# EAGLE design untitled2 (EAGLE 9.6.2)
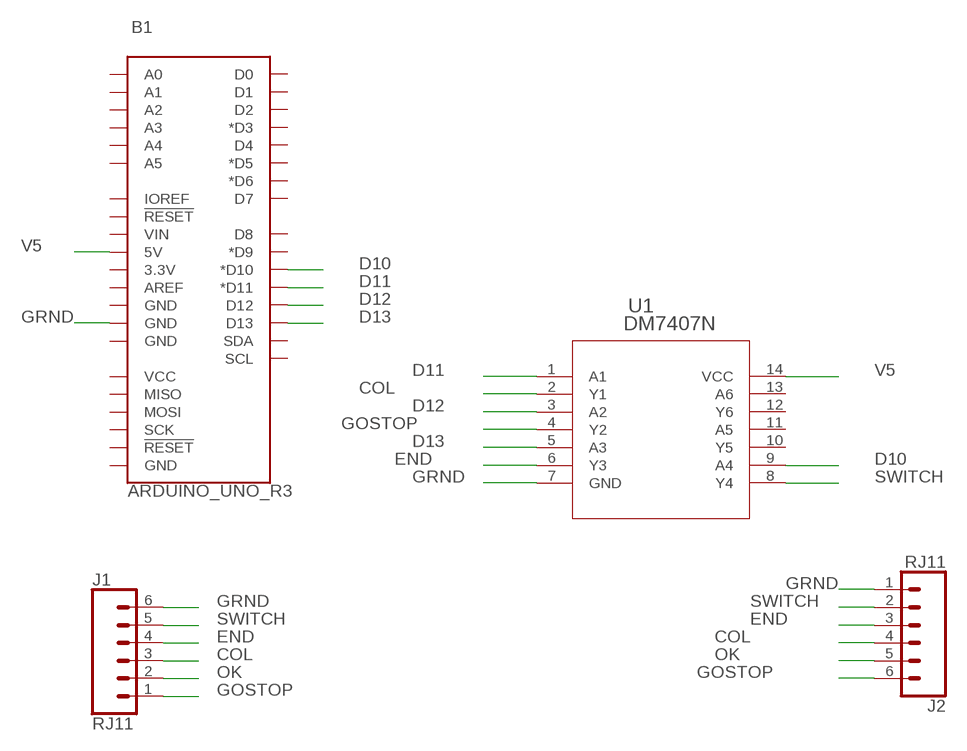
[diagram p0: schematic, sheet 1]

## Parts
B1  ARDUINO_UNO_R3  [ARDUINO_R3]
J1  RJ11  RJ11-6  [RJ11-6]
J2  RJ11  RJ11-6  [RJ11-6]
U1  DM7407N  [PDIP14_6P35X19P56_ONS]

## Nets
COL: J1.3 J2.4 U1.2(Y1)
D10: B1.D10(*D10) U1.9(A4)
D11: B1.D11(*D11) U1.1(A1)
D12: B1.D12 U1.3(A2)
D13: B1.D13 U1.5(A3)
END: J1.4 J2.3 U1.6(Y3)
GOSTOP: J1.1 J2.6 U1.4(Y2)
GRND: B1.GND@3(GND) J1.6 J2.1 U1.7(GND)
OK: J1.2 J2.5
SWITCH: J1.5 J2.2 U1.8(Y4)
V5: B1.5V U1.14(VCC)
Unconnected: B1.3.3V B1.A0 B1.A1 B1.A2 B1.A3 B1.A4 B1.A5 B1.AREF B1.D0 B1.D1 B1.D2 B1.D3(*D3) B1.D4 B1.D5(*D5) B1.D6(*D6) B1.D7 B1.D8 B1.D9(*D9) B1.GND@1(GND) B1.GND@2(GND) B1.GND@4(GND) B1.IOREF B1.MISO B1.MOSI B1.RESET@1(!RESET!) B1.RESET@2(!RESET!) B1.SCK B1.SCL B1.SDA B1.VCC B1.VIN U1.10(Y5) U1.11(A5) U1.12(Y6) U1.13(A6)

## Library data of the parts
B1 = SparkFun-Boards:ARDUINO_UNO_R3: Arduino R3 Footprint with SPI header Arduino Uno R3 Compatible Footprint. Matches PCB size of the original board. SparkFun Products: SAMD21 Dev Breakout <https://www.sparkfun.com/products/13672> RedBoard <https://www.sparkfun.com/products/12757> R3 Stackable Headers <https://www.sparkfun.com/products/11417>
J1 J2 = SparkFun-Connectors:RJ11-6: RJ11 Jack - 6 pin Commonly found on CAT3 devices and some Microchip programmers. Here is the connector we sell at SparkFun: RJ11 6-Pin Connector <https://www.sparkfun.com/products/132> (PRT-00132) Datasheet <http://www.sparkfun.com/datasheets/Prototyping/Connectors/RJ11-Datasheet.pdf> It is used on this SparkFun product: SparkFun Weather Shield <https://www.sparkfun.com/products/12081> (DEV-12081) Weather Meters <https://www.sparkfun.com/products/8942> (SEN-08942); PROD_ID: CONN-08590; SF_ID: PRT-00132
U1 = DM7407N:DM7407N; COPYRIGHT: Copyright (C) 2024 Ultra Librarian. All rights reserved.; MANUFACTURER_PART_NUMBER: DM7407N; MFR_NAME: onsemi / Fairchild Semiconductor

## Board
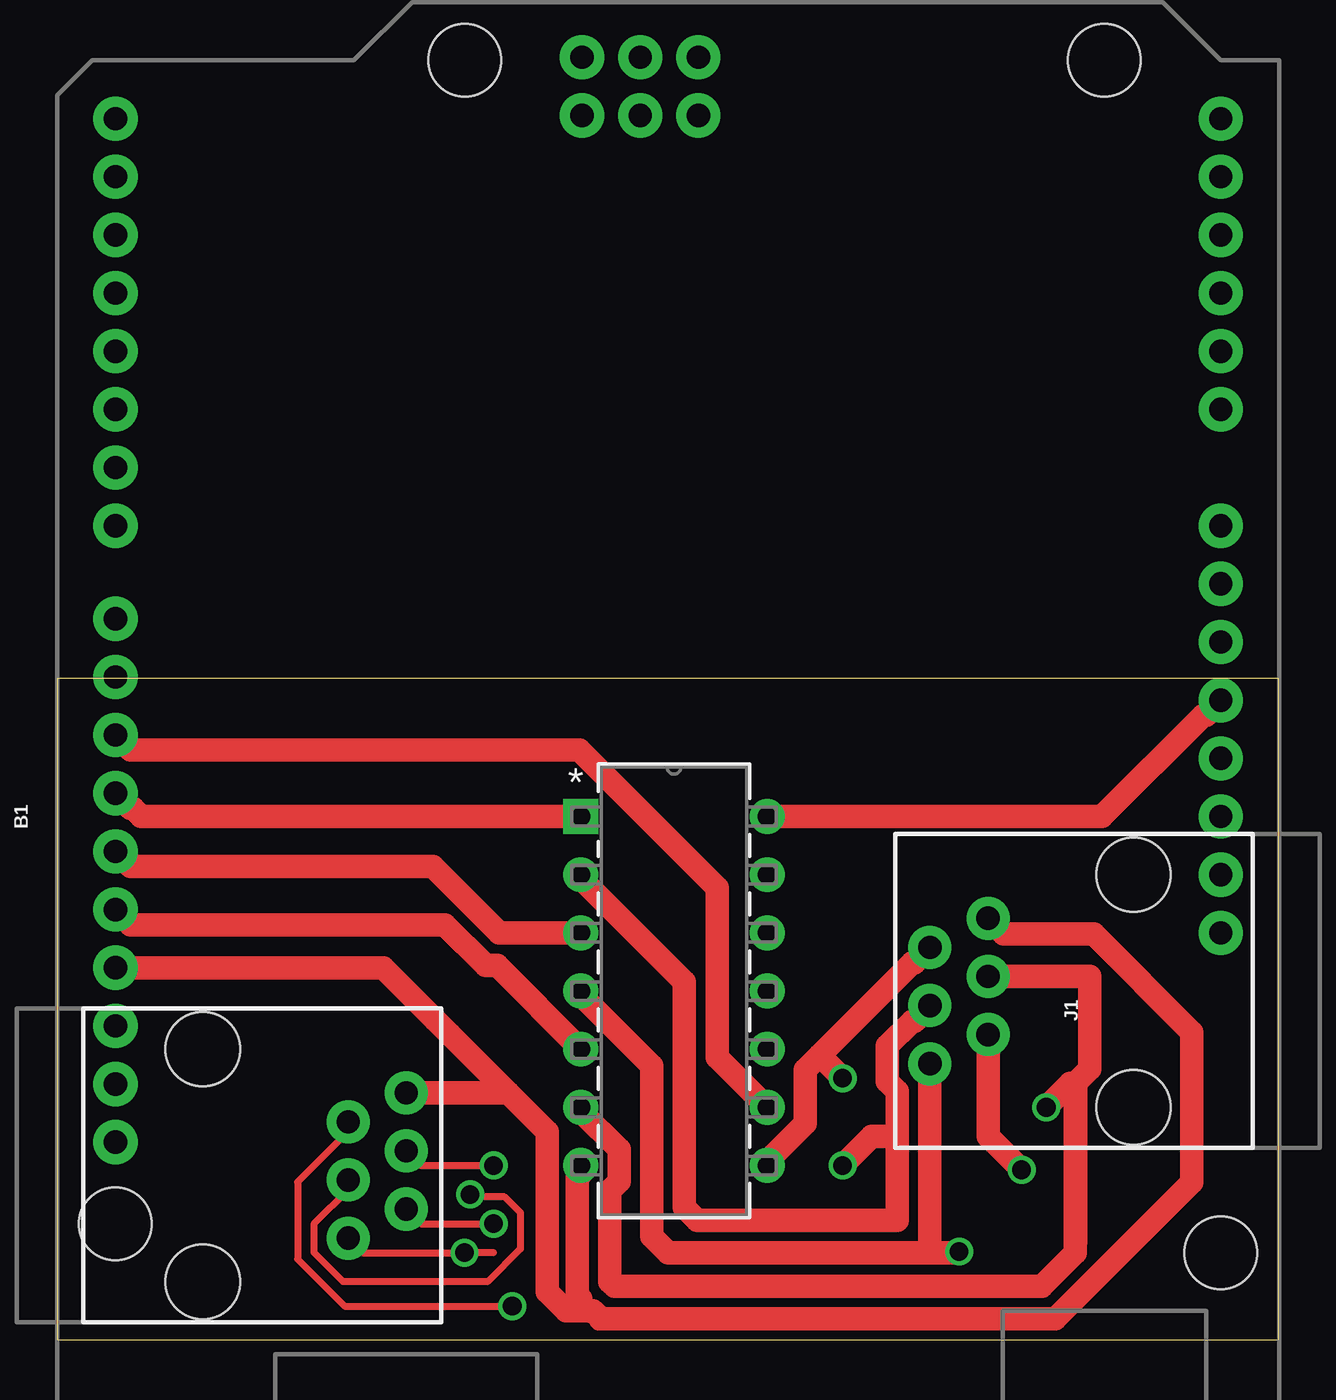
[diagram p1: board, top side]
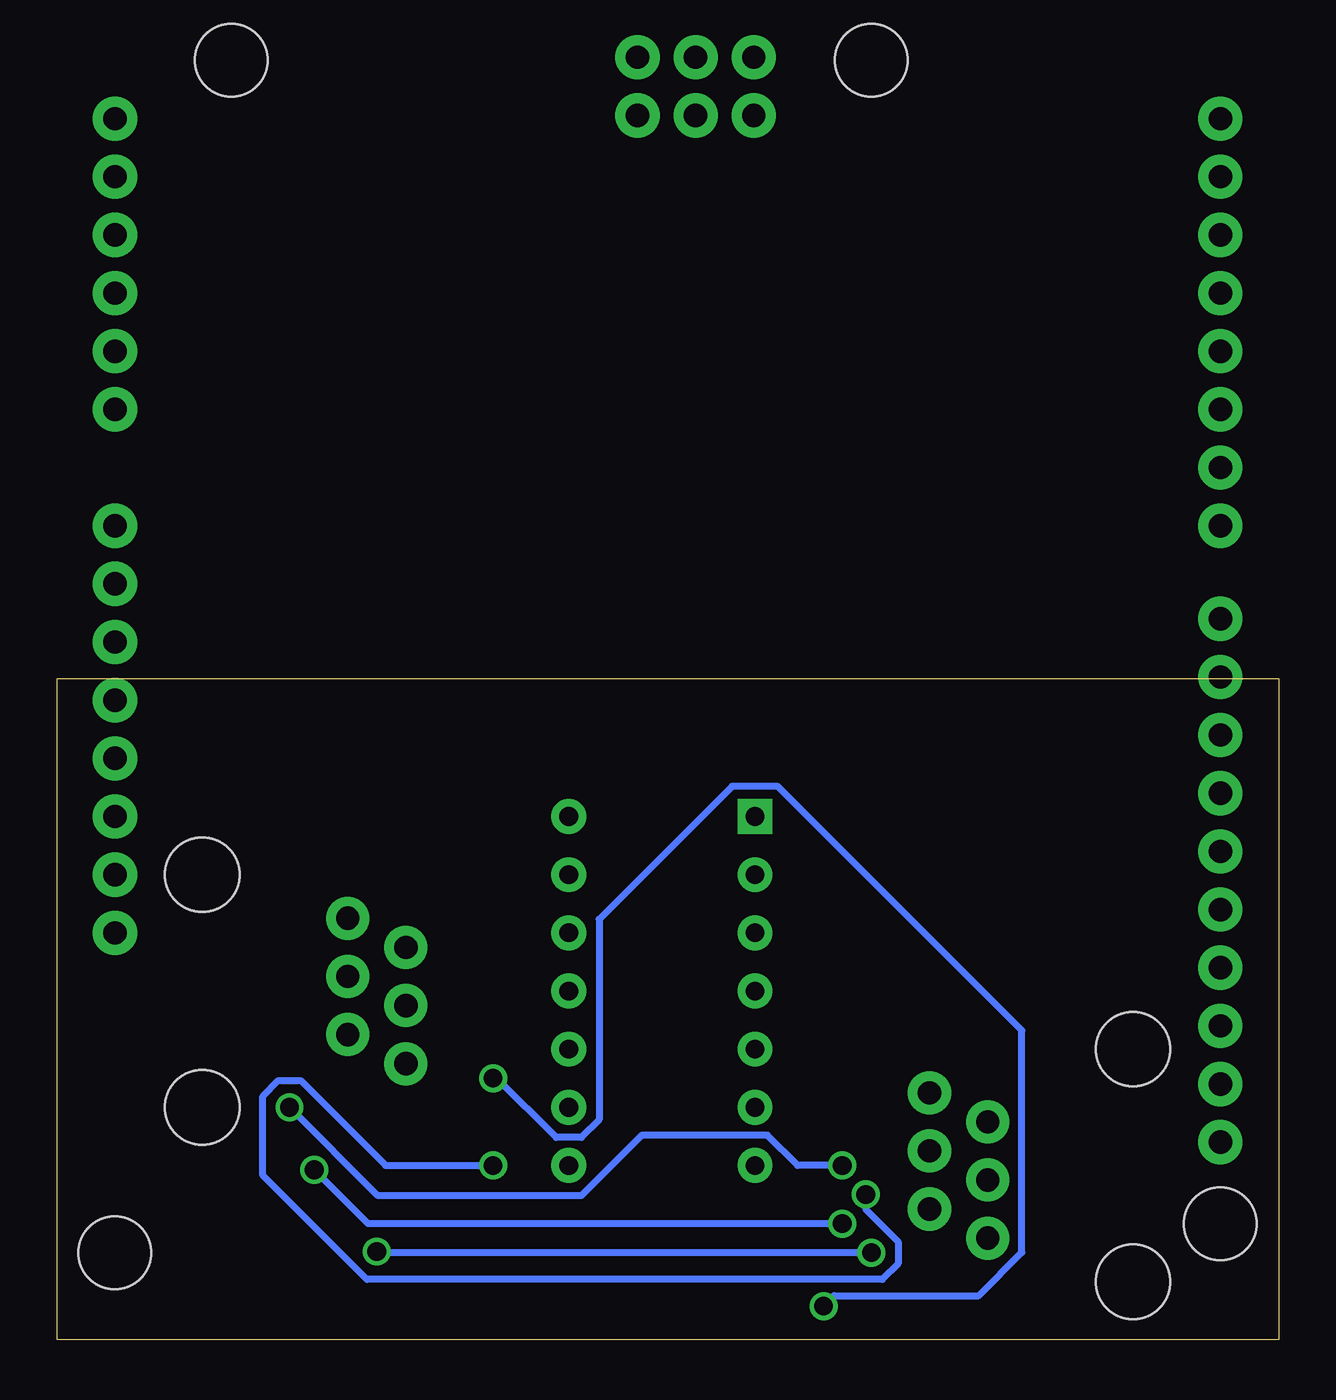
[diagram p2: board, bottom side, seen from below]

Size 53.32 x 28.88 mm. Coordinates in mm from the lower left corner, seen from the top.
Outline: 0,0 53.32,0 53.32,28.88 0,28.88 0,0
Copper layers (1*16): Top 0.035mm / dielectric 1.5mm / Bottom 0.035mm
Design rules "fabcity-designrules": minimum track width 10mil, minimum drill 32mil, track to track 16mil, track to pad 16mil, pad to pad 16mil, via to via 16mil, smd to smd 6mil, copper to edge 16mil, drill to drill 16mil, minimum pad ring 10mil, minimum via ring 8mil, stop-mask expansion 4mil, vias tented up to drill 0mil, thermal gap 16mil

### Footprints (pad centres in the part's own frame; a part is rotated, then mirrored left to right if it is on the bottom)
ARDUINO_R3 = drill 1.016 pad 1.93: 3.3V 2.54,-24.13; 5V 5.08,-24.13; A0 17.78,-24.13; A1 20.32,-24.13; A2 22.86,-24.13; A3 25.4,-24.13; A4 27.94,-24.13; A5 30.48,-24.13; AREF -9.144,24.13; D0 30.48,24.13; D1 27.94,24.13; D2 25.4,24.13; D3 22.86,24.13; D4 20.32,24.13; D5 17.78,24.13; D6 15.24,24.13; D7 12.7,24.13; D8 8.636,24.13; D9 6.096,24.13; D10 3.556,24.13; D11 1.016,24.13; D12 -1.524,24.13; D13 -4.064,24.13; GND@1 7.62,-24.13; GND@2 10.16,-24.13; GND@3 -6.604,24.13; GND@4 33.16,-1.32; IOREF -2.54,-24.13; MISO 30.62,3.76; MOSI 33.16,1.22; NC -5.08,-24.13; RESET@1 0,-24.13; RESET@2 30.62,-1.32; SCK 30.62,1.22; SCL -14.224,24.13; SDA -11.684,24.13; VCC 33.16,3.76; VIN 12.7,-24.13 | hole 3.175: -17.78,24.13; 33.02,8.89; 33.02,-19.05; -19.05,-24.13
RJ11-6 = drill 1.016 pad 1.88: 1 -3.175,8.89; 2 -1.905,6.35; 3 -0.635,8.89; 4 0.635,6.35; 5 1.905,8.89; 6 3.175,6.35 | hole 3.251: -5.08,0; 5.08,0
PDIP14_6P35X19P56_ONS = drill 0.813 pad 1.524 square: 1 0,0 | drill 0.813 pad 1.524: 2 0,-2.54; 3 0,-5.08; 4 0,-7.62; 5 0,-10.16; 6 0,-12.7; 7 0,-15.24; 8 8.128,-15.24; 9 8.128,-12.7; 10 8.128,-10.16; 11 8.128,-7.62; 12 8.128,-5.08; 13 8.128,-2.54; 14 8.128,0

### Placement (x,y rotation side)
B1  26.67,22.86 90 top
J1  46.99,15.24 90 top
J2  6.35,7.62 270 top
U1  22.86,22.86 0 top

### Tracks (layer width: path | path; a pad name or v marks a point on that pad's centre or on a via)
COL  (via drill 0.81)
  Top 0.305: J2.4 12.7,6.56 11.2,5.07 11.2,3.82 12.49,2.54 18.79,2.54 20.22,3.97 20.22,5.56 19.53,6.25 18.12,6.25 v18.02,6.35
  Top 1.016: J1.3 37.41,13.92 37.33,13.92 36.25,12.83 36.25,11.3 36.68,10.87 36.68,8.89 | 36.68,8.89 36.68,5.23 27.94,5.23 27.38,5.79 27.38,15.63 22.86,20.15 U1.2 | v34.29,7.62 35.56,8.89 36.68,8.89
  Bottom 0.305: v18.02,6.35 18.02,5.7 16.61,4.29 16.61,3.33 17.3,2.64 39.8,2.64 44.35,7.19 44.35,10.64 43.66,11.33 42.7,11.33 38.99,7.62 v34.29,7.62
D10
  Top 1.016: B1.D10 3.2,25.76 22.78,25.76 28.8,19.73 28.8,12.34 U1.9
D11
  Top 1.016: U1.1 3.67,22.86 3.32,23.22 3.2,23.22 B1.D11
D12
  Top 1.016: U1.3 19.29,17.78 16.39,20.68 3.2,20.68 B1.D12
D13
  Top 1.016: B1.D13 3.2,18.14 16.92,18.14 18.7,16.36 19.2,16.36 U1.5
END  (via drill 0.81)
  Top 0.305: 44.81,11.07 44.81,4.17 44.45,3.81 | J2.3 15.87,7.62 v19.05,7.62
  Top 1.016: J1.4 45.08,15.88 45.08,11.85 44.45,11.21 | 44.45,11.21 44.45,3.81 42.98,2.34 24.33,2.34 24.13,2.54 24.13,6.52 24.54,6.93 24.54,8.31 22.86,9.99 U1.6 | v43.18,10.16 44.23,11.21 44.45,11.21
  Bottom 0.305: v19.05,7.62 20.99,7.62 22.31,8.94 27.8,8.94 30.44,6.3 39.32,6.3 v43.18,10.16
GOSTOP  (via drill 0.81)
  Top 0.305: 22.86,14.57 U1.4 | J2.6 13.33,3.81 v17.78,3.81 19.05,3.81
  Top 1.016: J1.1 38.1,3.81 | 38.1,3.81 26.67,3.81 25.96,4.52 25.96,11.97 22.86,15.07 U1.4 | 38.1,3.81 39.32,3.81 v39.37,3.86
  Bottom 0.305: v17.78,3.81 39.37,3.81 v39.37,3.86
GRND
  Top 0.813: 23.74,0.91 23.64,0.81 | 18.95,11.28 19.05,11.38 19.1,11.38 19.68,10.8
  Top 1.016: U1.7 22.86,7.26 22.71,7.11 22.71,1.95 22.86,1.8 22.86,1.27 | 22.86,1.27 23.39,1.27 23.74,0.91 43.57,0.91 49.53,6.88 49.53,13.44 45.24,17.73 41.33,17.73 J1.6 | 19.68,10.8 21.39,9.09 21.39,2.1 22.21,1.27 22.86,1.27 | 19.68,10.8 J2.1 | 19.68,10.8 17.14,13.34 16.51,13.97 14.22,16.26 B1.GND@3
OK  (via drill 0.81)
  Top 0.305: J2.5 15.87,5.08 v19.05,5.08
  Top 1.016: v42.1,7.43 40.64,8.89 J1.2
  Bottom 0.305: v19.05,5.08 39.75,5.08 v42.1,7.43
SWITCH  (via drill 0.81)
  Top 0.305: J2.2 12.7,9.1 10.49,6.9 10.49,3.53 12.55,1.47 v19.86,1.47
  Top 1.016: J1.5 37.41,16.46 37.33,16.46 33.3,12.42 | U1.8 30.99,7.79 32.66,9.47 32.66,11.79 33.3,12.42 | v34.29,11.43 33.3,12.42
  Bottom 0.305: v19.86,1.47 19.41,1.93 13.09,1.93 11.2,3.82 11.2,13.52 21.87,24.18 23.85,24.18 29.67,18.37 29.67,9.61 30.44,8.84 31.54,8.84 34.13,11.43 v34.29,11.43
V5
  Top 0.305: 45.72,22.86 U1.14
  Top 1.016: B1.5V 50.14,27.28 50.02,27.28 45.6,22.86 U1.14